# Altium project MCU098_LP-MSPM0G3507.PrjPcb (part 4 of 4)

## Sheet MCU098_07_Hardware.SchDoc: Hardware
size 431 x 279 mm; Date: Not shown in title block; ApprovedBy: Not shown in title block; CheckedBy: Not shown in title block; Author: Not shown in title block; CompanyName: Not shown in title block; DrawnBy: Johnson He; Engineer: Not shown in title block; Organization: Not shown in title block; Address1: Not shown in title block; Address2: Not shown in title block; Address3: Not shown in title block; Address4: Not shown in title block; DocumentNumber: 1; Revision: Use project parameter SCH_Rev; SheetNumber: 7; SheetTotal: 7; PageSetup: Record=PageOptions|CenterHorizontal=True|CenterVertical=True|PrintScale=1.00|XCorrection=1.00|YCorrection=1.00|PrintKind=0|BorderSize=5000000|LeftOffset=0|BottomOffset=0|Orientation=2|PaperLength=1000|PaperWidth=1000|Scale=100|PaperSource=15|PrintQuality=600|MediaType=1|DitherType=10|PaperKind=Letter|PrintScaleMode=1; CurrentTime: Not shown in title block; CurrentDate: Not shown in title block; Time: Not shown in title block; DocumentFullPathAndName: Not shown in title block; DocumentName: Not shown in title block; ModifiedDate: Not shown in title block; ImagePath: Not shown in title block
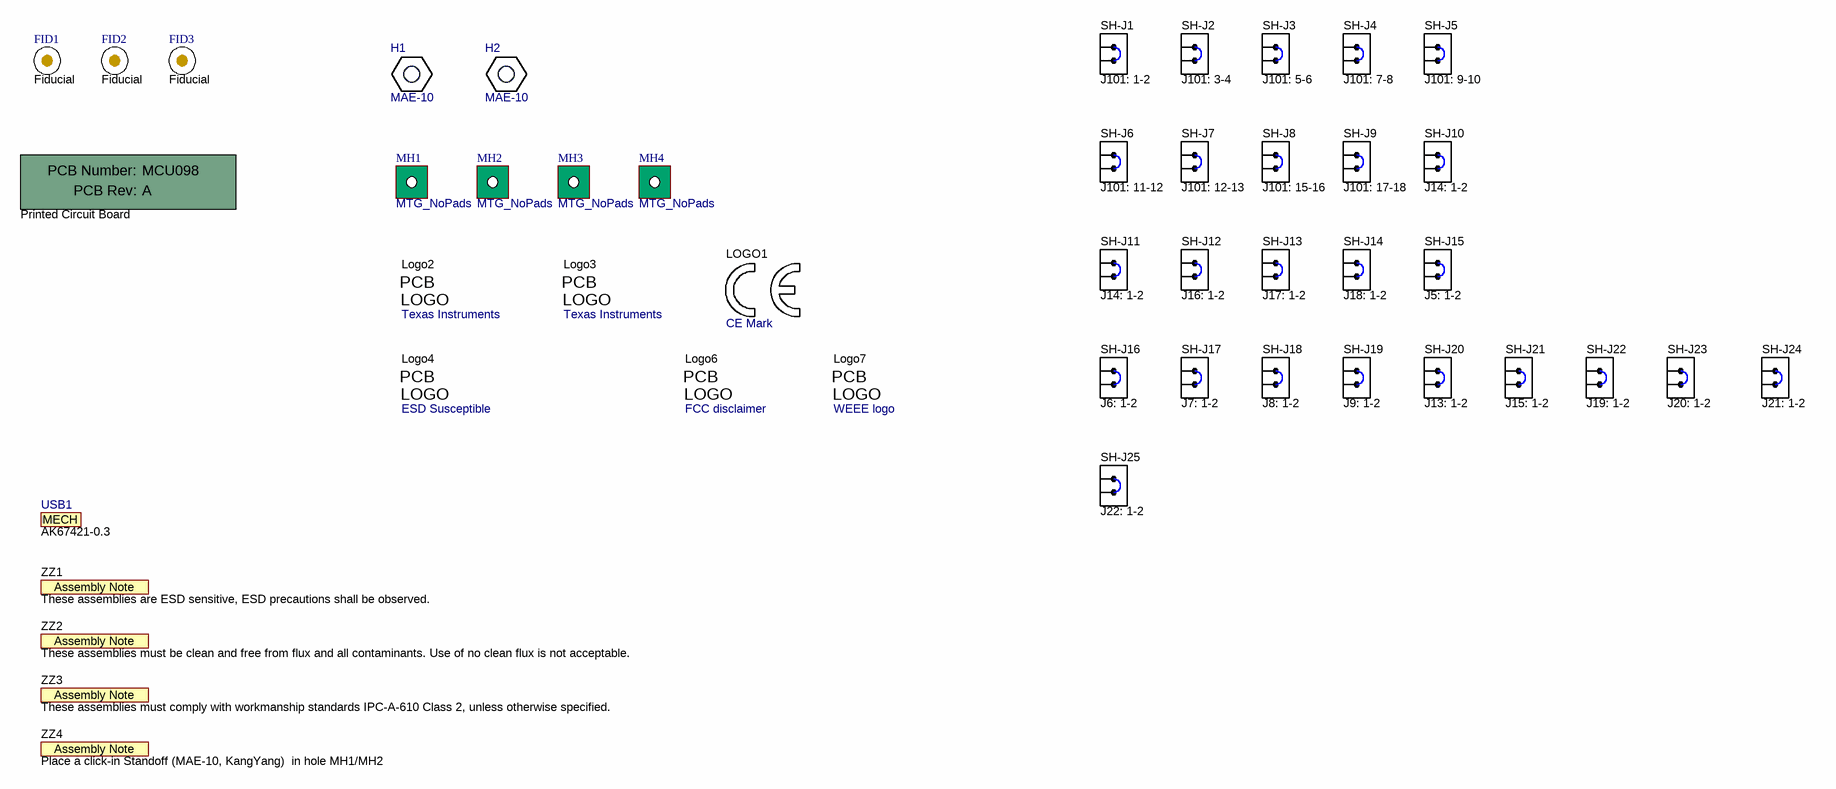
[diagram p6: MCU098_07_Hardware.SchDoc]

### Parts
!PCB1  Printed Circuit Board  (mechanical)
FID1  Fiducial  [Fiducial10-30]
FID2  Fiducial  [Fiducial10-30]
FID3  Fiducial  [Fiducial10-30]
H1  MAE-10  [KY_MAE-10]
H2  MAE-10  [KY_MAE-10]
LOGO1  CE Mark  [CE_Mark_5mm]  (no BOM)
Logo2  Texas Instruments  [TI_Horizontal_Overlay_Small]  (no BOM)
Logo3  Texas Instruments  [TI_Horizontal_Overlay_Medium]  (no BOM)
Logo4  ESD Susceptible  [ESD_Overlay_Large]  (no BOM)
Logo6  FCC disclaimer  [FCC_disclaimer]  (no BOM)
Logo7  WEEE logo  [WEEE_Minimum]  (no BOM)
MH1  MTG_NoPads  [NPTH125mil]  (no BOM)
MH2  MTG_NoPads  [NPTH125mil]  (no BOM)
MH3  MTG_NoPads  [NPTH125mil]  (no BOM)
MH4  MTG_NoPads  [NPTH125mil]  (no BOM)
SH-J1  value J101: 1-2  [SNT-100-BK-G]  (hidden comment: SNT-100-BK-G)
SH-J2  value J101: 3-4  [SNT-100-BK-G]  (hidden comment: SNT-100-BK-G)
SH-J3  value J101: 5-6  [SNT-100-BK-G]  (hidden comment: SNT-100-BK-G)
SH-J4  value J101: 7-8  [SNT-100-BK-G]  (hidden comment: SNT-100-BK-G)
SH-J5  value J101: 9-10  [SNT-100-BK-G]  (hidden comment: SNT-100-BK-G)
SH-J6  value J101: 11-12  [SNT-100-BK-G]  (hidden comment: SNT-100-BK-G)
SH-J7  value J101: 12-13  [SNT-100-BK-G]  (hidden comment: SNT-100-BK-G)
SH-J8  value J101: 15-16  [SNT-100-BK-G]  (hidden comment: SNT-100-BK-G)
SH-J9  value J101: 17-18  [SNT-100-BK-G]  (hidden comment: SNT-100-BK-G)
SH-J10  value J14: 1-2  [SNT-100-BK-G]  (hidden comment: SNT-100-BK-G)
SH-J11  value J14: 1-2  [SNT-100-BK-G]  (hidden comment: SNT-100-BK-G)
SH-J12  value J16: 1-2  [SNT-100-BK-G]  (hidden comment: SNT-100-BK-G)
SH-J13  value J17: 1-2  [SNT-100-BK-G]  (hidden comment: SNT-100-BK-G)
SH-J14  value J18: 1-2  [SNT-100-BK-G]  (hidden comment: SNT-100-BK-G)
SH-J15  value J5: 1-2  [SNT-100-BK-G]  (hidden comment: SNT-100-BK-G)
SH-J16  value J6: 1-2  [SNT-100-BK-G]  (hidden comment: SNT-100-BK-G)
SH-J17  value J7: 1-2  [SNT-100-BK-G]  (hidden comment: SNT-100-BK-G)
SH-J18  value J8: 1-2  [SNT-100-BK-G]  (hidden comment: SNT-100-BK-G)
SH-J19  value J9: 1-2  [SNT-100-BK-G]  (hidden comment: SNT-100-BK-G)
SH-J20  value J13: 1-2  [SNT-100-BK-G]  (hidden comment: SNT-100-BK-G)
SH-J21  value J15: 1-2  [SNT-100-BK-G]  (hidden comment: SNT-100-BK-G)
SH-J22  value J19: 1-2  [SNT-100-BK-G]  (hidden comment: SNT-100-BK-G)
SH-J23  value J20: 1-2  [SNT-100-BK-G]  (hidden comment: SNT-100-BK-G)
SH-J24  value J21: 1-2  [SNT-100-BK-G]  (hidden comment: SNT-100-BK-G)
SH-J25  value J22: 1-2  [SNT-100-BK-G]  (hidden comment: SNT-100-BK-G)
USB1  AK67421-0.3  (mechanical)
ZZ1  These assemblies are ESD sensitive, ESD precautions shall be observed.  [AssemblyNote]  (no BOM)
ZZ2  These assemblies must be clean and free from flux and all contaminants. Use of no clean flux is not acceptable.  [AssemblyNote]  (no BOM)
ZZ3  These assemblies must comply with workmanship standards IPC-A-610 Class 2, unless otherwise specified.  [AssemblyNote]  (no BOM)
ZZ4  Place a click-in Standoff (MAE-10, KangYang)  in hole MH1/MH2  [AssemblyNote]  (no BOM)

### Notes on the sheet
- Drawn By:
- SVN Rev:
- Number:
- TID #:
- Orderable:
- Rev:
- Sheet Title:
- File:
- Project Title:
- Designed for:
- Assembly Variant:
- Mod. Date:
- Sheet:
- Size:
- of
- B
- http://www.ti.com
- Texas Instruments and/or its licensors do not warrant the accuracy or completeness of this specification or any information contained therein. Texas Instruments and/or its licensors do not warrant that this design will meet the specifications, will be suitable for your application or fit for any particular purpose, or will operate in an implementation. Texas Instruments and/or its licensors do not warrant that the design is production worthy. You should completely validate and test your design implementation to confirm the system functionality for your application.
- Engineer:
- Contact:
- © Texas Instruments
- (in symbol AssemblyNote) Assembly Note
- (in symbol CMP-0003618-2) PCB Number:; PCB Rev:
- (in symbol CMP-0074769-1) PCB; LOGO
- (in symbol CMP-0074838-1) PCB; LOGO
- (in symbol CMP-0074840-1) PCB; LOGO
- (in symbol CMP-0074847-1) PCB; LOGO
- (in symbol CMP-0077983-1) MECH

### Library data of the parts
!PCB1 = CMP-0003618-2: PartNumber: MCU098; Manufacturer: Any; LatestRevisionDate: 2017-03-09; CompType: PCB; Publisher: Texas Instruments; RoHS: O; MountType: N/A; Key: PCB
FID1-FID3 = CMP-0077181-1: Fiducial mark.  There is nothing to buy or mount.; CompType: Fiducial; PackageReference: N/A; Library Reference: Fiducial; ClassName: FiducialMark; Manufacturer: N/A; MountType: N/A; PartNumber: N/A
H1 H2 = CMP-0077978-1: Spacer Support, Nylon 66; Manufacturer: Kang Yang; CompType: Standoff; PartNumber: MAE-10; Key: MAE-10; PackageReference: Spacer Nylon Support; ComponentLink1Description: Datasheet Link; MountType: N/A; ComponentLink1URL: https://sps16.itg.ti.com/sites/KMS/crossdivteams/altium/docs/ComponentDatasheets/1104004000018---MAE-10.pdf; RoHS: Y
LOGO1 = CMP-0074844-1: SymbolCreator: a0412235; Publisher: Texas Instruments; Library Reference: CE Mark; Lib Reference: CE Mark; LatestRevisionDate: 2017-07-06; PartNumber: CE Mark; Published: 2009-03-03
Logo2 Logo3 = CMP-0074838-1: Texas Instrument Corporate Signature; SymbolCreator: a0412235; Lib Reference: TI_Logo; ClassName: Logo; Library Reference: Logo; Publisher: Texas Instruments; SymbolVersion: 2011-08-22; Published: 2009-03-03; LatestRevisionDate: 2017-07-06; PartNumber: Texas Instruments
Logo4 = CMP-0074840-1: ESD Susceptible Symbol; SymbolCreator: a0412235; Lib Reference: ESD_Susceptible; Library Reference: Logo; Publisher: Texas Instruments; SymbolVersion: 2011-08-22; Published: 2009-03-03; LatestRevisionDate: 2017-07-06; PartNumber: ESD Susceptible
Logo6 = CMP-0074847-1: FCC_disclaimer; Publisher: Texas Instruments; Lib Reference: FCC_disclaimer; Library Reference: Logo; LatestRevisionDate: 2017-07-06; PartNumber: FCC disclaimer; Published: 2009-03-03
Logo7 = CMP-0074769-1: Library Reference: WEEE logo; Lib Reference: WEEE logo; PartNumber: WEEE logo
MH1-MH4 = CMP-0078424-2: PCB Mounting Hole, No Pad; Manufacturer: Any; Key: Mounting Hole (non-standard) No Pad; CompType: Mounting Hole; PackageReference: Mounting Hole; PartNumber: N/A; MountType: N/A
SH-J1-SH-J25 = CMP-0003623-3: Shunt, 100mil, Gold plated, Black; Alternate PartNumber: 969102-0000-DA; Manufacturer: Samtec; Alternate Manufacturer: 3M; ComponentLink1URL: http://www.samtec.com/ftppub/pdf/SNT.PDF; Supplier 1: Digi-Key; CompType: Shunt; PackageReference: Shunt; ClassName: Shunt; RoHS: Y; Supplier Part Number 1: SAM8858-ND; MountType: N/A; PartNumber: SNT-100-BK-G; ComponentLink1Description: Datasheet Link
USB1 = CMP-0077983-1: Cable, USB-A to micro USB-B, 0.3 m; Manufacturer: Assman WSW; ComponentLink1URL: http://www.assmann-wsw.com/fileadmin/datasheets/ASS_7091_CA.pdf; Key: AK67421-0.3; CompType: Cable; Supplier 1: Digi-Key; RoHS: Y; Supplier Part Number 1: AE11229-ND; PartNumber: AK67421-0.3; MountType: N/A; ComponentLink1Description: Datasheet Link
ZZ1-ZZ4 = AssemblyNote: SymbolCreator: codlsc; SymbolVersion: 2010-05-18; CompType: AssemblyNote; ClassName: AssemblyNote; Publisher: Texas Instruments; LatestRevisionDate: 2012-06-14; LatestRevisionNote: Initial Version; Alternate Manufacturer: -; Alternate PartNumber: -

## Nets that join several sheets
3V3: MCU098_01_MSPM0G3507_Target_Device (10 pins), MCU098_02_BoosterPack_Connectors (7 pins), MCU098_05_XDS110_Target_Interface (J101.6 J103.1 U1.8)
+5V: MCU098_01_MSPM0G3507_Target_Device (J10.1 R12.2 R16.2), MCU098_02_BoosterPack_Connectors (J1/J3.21 J23.1 J23.2), MCU098_05_XDS110_Target_Interface (J101.4)
GND: MCU098_01_MSPM0G3507_Target_Device (33 pins), MCU098_02_BoosterPack_Connectors (23 pins), MCU098_05_XDS110_Target_Interface (6 pins)
XDS_GND: MCU098_03_XDS110_Debug_Probe (37 pins), MCU098_04_XDS110-ET_EnergyTrace (27 pins), MCU098_05_XDS110_Target_Interface (6 pins), MCU098_06_XDS110-ET_USB_Power (11 pins)
XDS_VCC: MCU098_03_XDS110_Debug_Probe (26 pins), MCU098_04_XDS110-ET_EnergyTrace (11 pins), MCU098_05_XDS110_Target_Interface (IC2.8 J102.1 R85.2), MCU098_06_XDS110-ET_USB_Power (5 pins)
3.3VM: MCU098_01_MSPM0G3507_Target_Device (J13.1), MCU098_02_BoosterPack_Connectors (R56.2 U2.8)
BSL_INVOKE: MCU098_03_XDS110_Debug_Probe (XDS1.42), MCU098_05_XDS110_Target_Interface (IC2.1 J101.17)
DCDCIO0: MCU098_03_XDS110_Debug_Probe (XDS1.5), MCU098_04_XDS110-ET_EnergyTrace (XDS2.4)
DCDCIO1: MCU098_03_XDS110_Debug_Probe (XDS1.6), MCU098_04_XDS110-ET_EnergyTrace (XDS2.5)
DCDCPULSE: MCU098_03_XDS110_Debug_Probe (XDS1.127), MCU098_04_XDS110-ET_EnergyTrace (R47.2 XDS2.3)
DCDCRST: MCU098_03_XDS110_Debug_Probe (TP1.1 XDS1.11), MCU098_04_XDS110-ET_EnergyTrace (C35.1 R45.1 XDS2.9)
DCDCTEST: MCU098_03_XDS110_Debug_Probe (TP3.1 XDS1.27), MCU098_04_XDS110-ET_EnergyTrace (R46.2 XDS2.10)
HOSTSCL: MCU098_03_XDS110_Debug_Probe (XDS1.49), MCU098_04_XDS110-ET_EnergyTrace (R42.1 XDS2.7)
HOSTSDA: MCU098_03_XDS110_Debug_Probe (XDS1.50), MCU098_04_XDS110-ET_EnergyTrace (R41.1 XDS2.8)
IRSTN: MCU098_03_XDS110_Debug_Probe (R33.1), MCU098_06_XDS110-ET_USB_Power (TP9.1)
ITCK: MCU098_03_XDS110_Debug_Probe (XDS1.100), MCU098_06_XDS110-ET_USB_Power (R92.2 TP6.1)
ITDI: MCU098_03_XDS110_Debug_Probe (XDS1.98), MCU098_06_XDS110-ET_USB_Power (TP8.1)
ITDO: MCU098_03_XDS110_Debug_Probe (XDS1.97), MCU098_06_XDS110-ET_USB_Power (TP7.1)
ITMS: MCU098_03_XDS110_Debug_Probe (XDS1.99), MCU098_06_XDS110-ET_USB_Power (R91.2 TP5.1)
PA0-: MCU098_01_MSPM0G3507_Target_Device (J19.2 R13.2), MCU098_02_BoosterPack_Connectors (J27.9)
PA1-: MCU098_01_MSPM0G3507_Target_Device (J20.2 R19.2), MCU098_02_BoosterPack_Connectors (J28.9)
PA2-: MCU098_01_MSPM0G3507_Target_Device (R9.1), MCU098_02_BoosterPack_Connectors (J28.1)
PA3-: MCU098_01_MSPM0G3507_Target_Device (R10.1), MCU098_02_BoosterPack_Connectors (J28.2)
PA4-: MCU098_01_MSPM0G3507_Target_Device (R11.1), MCU098_02_BoosterPack_Connectors (J28.3)
PA5-: MCU098_01_MSPM0G3507_Target_Device (R15.1), MCU098_02_BoosterPack_Connectors (J28.4)
PA6-: MCU098_01_MSPM0G3507_Target_Device (R17.1), MCU098_02_BoosterPack_Connectors (J28.5)
PA7_CLK-OUT: MCU098_01_MSPM0G3507_Target_Device (MSP1.49), MCU098_02_BoosterPack_Connectors (J28.6)
PA8_UART1-TX: MCU098_01_MSPM0G3507_Target_Device (MSP1.54), MCU098_02_BoosterPack_Connectors (J1/J3.4)
PA9_UART1-RX: MCU098_01_MSPM0G3507_Target_Device (MSP1.55), MCU098_02_BoosterPack_Connectors (J14.3)
PA10_UART0-TX_BP: MCU098_01_MSPM0G3507_Target_Device (J21.3), MCU098_02_BoosterPack_Connectors (J2/J4.34 R62.2)
PA10_UART0-TX_XDS: MCU098_01_MSPM0G3507_Target_Device (J21.1), MCU098_05_XDS110_Target_Interface (J101.10)
PA11_UART0-RX_BP: MCU098_01_MSPM0G3507_Target_Device (J22.3), MCU098_02_BoosterPack_Connectors (J2/J4.33 R63.2)
PA11_UART0-RX_XDS: MCU098_01_MSPM0G3507_Target_Device (J22.1), MCU098_05_XDS110_Target_Interface (J101.8)
PA12_CAN-TX: MCU098_01_MSPM0G3507_Target_Device (MSP1.5), MCU098_02_BoosterPack_Connectors (J2/J4.32 R64.2)
PA13_CAN-RX: MCU098_01_MSPM0G3507_Target_Device (MSP1.6), MCU098_02_BoosterPack_Connectors (J2/J4.31 R65.2)
PA14_TIMH0-C0: MCU098_01_MSPM0G3507_Target_Device (MSP1.7), MCU098_02_BoosterPack_Connectors (J28.7)
PA15_DAC-OUT: MCU098_01_MSPM0G3507_Target_Device (MSP1.8), MCU098_02_BoosterPack_Connectors (R55.1)
PA16_OPA1-OUT_ADC1.1: MCU098_01_MSPM0G3507_Target_Device (MSP1.9), MCU098_02_BoosterPack_Connectors (J15.1)
PA17_OPA1-IN-_ADC1.2: MCU098_01_MSPM0G3507_Target_Device (MSP1.10), MCU098_02_BoosterPack_Connectors (R82.2)
PA18-: MCU098_01_MSPM0G3507_Target_Device (J8.1 R23.1), MCU098_05_XDS110_Target_Interface (J101.18 U1.5)
PA18_OPA1-IN+_ADC1.3_GPAMP-IN-: MCU098_01_MSPM0G3507_Target_Device (MSP1.11 R23.2), MCU098_02_BoosterPack_Connectors (6 pins)
PA19_SWDIO: MCU098_01_MSPM0G3507_Target_Device (MSP1.12), MCU098_05_XDS110_Target_Interface (J101.14 J103.2 U1.7)
PA20_SWCLK: MCU098_01_MSPM0G3507_Target_Device (MSP1.13), MCU098_05_XDS110_Target_Interface (J101.16 J103.4 U1.6)
PA21-: MCU098_01_MSPM0G3507_Target_Device (R20.1), MCU098_02_BoosterPack_Connectors (J28.8)
PA22_OPA0-OUT_ADC0.7_GPAMP-OUT_COMP2-IN0+: MCU098_01_MSPM0G3507_Target_Device (J16.2 MSP1.18), MCU098_02_BoosterPack_Connectors (C46.2 R61.2 R84.2)
PA23-: MCU098_01_MSPM0G3507_Target_Device (R22.1), MCU098_02_BoosterPack_Connectors (J28.10)
PA24_OPA0-IN1-_ADC0.3: MCU098_01_MSPM0G3507_Target_Device (MSP1.25), MCU098_02_BoosterPack_Connectors (R80.2)
PA25_OPA0-IN1+_ADC0.2: MCU098_01_MSPM0G3507_Target_Device (MSP1.26), MCU098_02_BoosterPack_Connectors (J1/J3.2)
PA26_OPA0-IN0+_GPAMP-IN+_COMP0-IN0+: MCU098_01_MSPM0G3507_Target_Device (J18.2 MSP1.30), MCU098_02_BoosterPack_Connectors (J1/J3.5 R57.1)
PA27_OPA0-IN0-_COMP0-IN0-_TIMA2_FAL: MCU098_01_MSPM0G3507_Target_Device (J17.2 MSP1.31), MCU098_02_BoosterPack_Connectors (J1/J3.8)
PA28_TIMA2_C0: MCU098_01_MSPM0G3507_Target_Device (MSP1.35), MCU098_02_BoosterPack_Connectors (J2/J4.38)
PA29_TIMG10_C0: MCU098_01_MSPM0G3507_Target_Device (MSP1.36), MCU098_02_BoosterPack_Connectors (J12.1)
PA30_TIMG10_C1: MCU098_01_MSPM0G3507_Target_Device (MSP1.37), MCU098_02_BoosterPack_Connectors (J12.2)
PA31_TIMA2_C1: MCU098_01_MSPM0G3507_Target_Device (MSP1.39), MCU098_02_BoosterPack_Connectors (J2/J4.37)
PB0_SPI1-CS2: MCU098_01_MSPM0G3507_Target_Device (MSP1.47), MCU098_02_BoosterPack_Connectors (J2/J4.12)
PB1_TIMA1-C1: MCU098_01_MSPM0G3507_Target_Device (MSP1.48), MCU098_02_BoosterPack_Connectors (J2/J4.39)
PB2_I2C1-SCL: MCU098_01_MSPM0G3507_Target_Device (MSP1.50), MCU098_02_BoosterPack_Connectors (J1/J3.9 R59.2)
PB3_I2C1-SDA: MCU098_01_MSPM0G3507_Target_Device (MSP1.51), MCU098_02_BoosterPack_Connectors (J1/J3.10 R60.2)
PB4_TIMA1-C0: MCU098_01_MSPM0G3507_Target_Device (MSP1.52), MCU098_02_BoosterPack_Connectors (J2/J4.40)
PB5: MCU098_01_MSPM0G3507_Target_Device (MSP1.53), MCU098_02_BoosterPack_Connectors (J27.1)
PB6_SPI1-CS0: MCU098_01_MSPM0G3507_Target_Device (MSP1.58), MCU098_02_BoosterPack_Connectors (J2/J4.13)
PB7_SPI1-POCI: MCU098_01_MSPM0G3507_Target_Device (MSP1.59), MCU098_02_BoosterPack_Connectors (J2/J4.14)
PB8_SPI1-PICO: MCU098_01_MSPM0G3507_Target_Device (MSP1.60), MCU098_02_BoosterPack_Connectors (J2/J4.15)
PB9_SPI1-SCK: MCU098_01_MSPM0G3507_Target_Device (MSP1.61), MCU098_02_BoosterPack_Connectors (J1/J3.7)
PB10_TIMG0-C0: MCU098_01_MSPM0G3507_Target_Device (MSP1.62), MCU098_02_BoosterPack_Connectors (J27.2)
PB11_TIMG0-C1: MCU098_01_MSPM0G3507_Target_Device (MSP1.63), MCU098_02_BoosterPack_Connectors (J27.3)
PB12_TIMA0-C2_TIMA1-FAL: MCU098_01_MSPM0G3507_Target_Device (MSP1.64), MCU098_02_BoosterPack_Connectors (J2/J4.19)
PB13_TIMA0-C3: MCU098_01_MSPM0G3507_Target_Device (MSP1.1), MCU098_02_BoosterPack_Connectors (J2/J4.35)
PB14_TIMG10_IDX: MCU098_01_MSPM0G3507_Target_Device (MSP1.2), MCU098_02_BoosterPack_Connectors (J12.3)
PB15_UART2-TX_TIMG1-C0: MCU098_01_MSPM0G3507_Target_Device (MSP1.3), MCU098_02_BoosterPack_Connectors (J2/J4.17)
PB16_UART2-RX_TIMG1-C1: MCU098_01_MSPM0G3507_Target_Device (MSP1.4), MCU098_02_BoosterPack_Connectors (J2/J4.11)
PB17_ADC1.4_SPI1-CS1: MCU098_01_MSPM0G3507_Target_Device (MSP1.14), MCU098_02_BoosterPack_Connectors (J2/J4.18)
PB18_ADC1.5: MCU098_01_MSPM0G3507_Target_Device (MSP1.15), MCU098_02_BoosterPack_Connectors (R76.2)
PB19_OPA1-IN+_ADC1.6: MCU098_01_MSPM0G3507_Target_Device (MSP1.16), MCU098_02_BoosterPack_Connectors (R78.2)
PB20_TIMA0-C2: MCU098_01_MSPM0G3507_Target_Device (MSP1.19), MCU098_02_BoosterPack_Connectors (J2/J4.36)
PB21: MCU098_01_MSPM0G3507_Target_Device (MSP1.20 S2.3), MCU098_02_BoosterPack_Connectors (J27.4)
PB22: MCU098_01_MSPM0G3507_Target_Device (J5.1 MSP1.21), MCU098_02_BoosterPack_Connectors (J27.5)
PB23_TIMA0-FAL: MCU098_01_MSPM0G3507_Target_Device (MSP1.22), MCU098_02_BoosterPack_Connectors (J14.1 J27.6)
PB24_ADC0.5_COMP1-IN1+: MCU098_01_MSPM0G3507_Target_Device (MSP1.23), MCU098_02_BoosterPack_Connectors (J1/J3.6 J9.1)
PB25_ADC0.4_TIMA2-FAL: MCU098_01_MSPM0G3507_Target_Device (MSP1.27), MCU098_02_BoosterPack_Connectors (C47.1 R72.2 R74.2)
PB26: MCU098_01_MSPM0G3507_Target_Device (J6.1 MSP1.28), MCU098_02_BoosterPack_Connectors (J27.8)
PB27: MCU098_01_MSPM0G3507_Target_Device (J7.1 MSP1.29), MCU098_02_BoosterPack_Connectors (J27.10)
~{RST}: MCU098_01_MSPM0G3507_Target_Device (C6.1 MSP1.38 R2.1 S3.4), MCU098_02_BoosterPack_Connectors (J2/J4.16), MCU098_05_XDS110_Target_Interface (J101.12 J103.10 U1.2)
REF_MAIN_LDO: MCU098_03_XDS110_Debug_Probe (XDS1.128), MCU098_04_XDS110-ET_EnergyTrace (R51.1 R54.2)
REF_TARGET_VCC: MCU098_03_XDS110_Debug_Probe (XDS1.120), MCU098_04_XDS110-ET_EnergyTrace (R50.1 R53.2)
VBUS_DETECT: MCU098_03_XDS110_Debug_Probe (XDS1.1), MCU098_06_XDS110-ET_USB_Power (R87.2 R88.2)
VCCEN1: MCU098_03_XDS110_Debug_Probe (TP2.1 XDS1.78), MCU098_04_XDS110-ET_EnergyTrace (IC1.1 R49.2)
XDS_DM: MCU098_03_XDS110_Debug_Probe (XDS1.93), MCU098_06_XDS110-ET_USB_Power (IC3.5 USB2.2)
XDS_DP: MCU098_03_XDS110_Debug_Probe (XDS1.94), MCU098_06_XDS110-ET_USB_Power (IC3.4 USB2.3)
XDS_ID: MCU098_03_XDS110_Debug_Probe (XDS1.95), MCU098_06_XDS110-ET_USB_Power (IC3.2 USB2.4)
XDS_RESET_OUT: MCU098_03_XDS110_Debug_Probe (XDS1.40), MCU098_05_XDS110_Target_Interface (IC2.2 J101.11 J102.10 R85.1)
XDS_RXD: MCU098_03_XDS110_Debug_Probe (XDS1.33), MCU098_05_XDS110_Target_Interface (J101.9)
XDS_TCK_SWDCLK: MCU098_03_XDS110_Debug_Probe (XDS1.35), MCU098_05_XDS110_Target_Interface (IC2.6 J101.15 J102.4)
XDS_TDI: MCU098_03_XDS110_Debug_Probe (XDS1.38), MCU098_05_XDS110_Target_Interface (IC2.3 J102.8)
XDS_TDO_SWO: MCU098_03_XDS110_Debug_Probe (XDS1.37), MCU098_05_XDS110_Target_Interface (IC2.5 J102.6)
XDS_TMS_SWDIO: MCU098_03_XDS110_Debug_Probe (XDS1.36), MCU098_05_XDS110_Target_Interface (IC2.7 J101.13 J102.2)
XDS_TXD: MCU098_03_XDS110_Debug_Probe (XDS1.34), MCU098_05_XDS110_Target_Interface (J101.7)
XDS_VBUS: MCU098_03_XDS110_Debug_Probe (R28.1), MCU098_04_XDS110-ET_EnergyTrace (5 pins), MCU098_05_XDS110_Target_Interface (J101.3), MCU098_06_XDS110-ET_USB_Power (7 pins)
XDS_VCCTARGET: MCU098_04_XDS110-ET_EnergyTrace (C39.1 C40.1 IC1.4 R50.2), MCU098_05_XDS110_Target_Interface (J101.5)

## Assembly variants
Variant 1: not fitted C4 C7 C45 C46 C48 C49 C50 C51 C52 J18 R9 R10 R11 R15 R17 R20 R22 R27 R50 R53 R59 R60 R61 R66 R67 R68 R70 R74 TP1 TP2 TP3 TP4 TP5 TP6 TP7 TP8 TP9 TP10